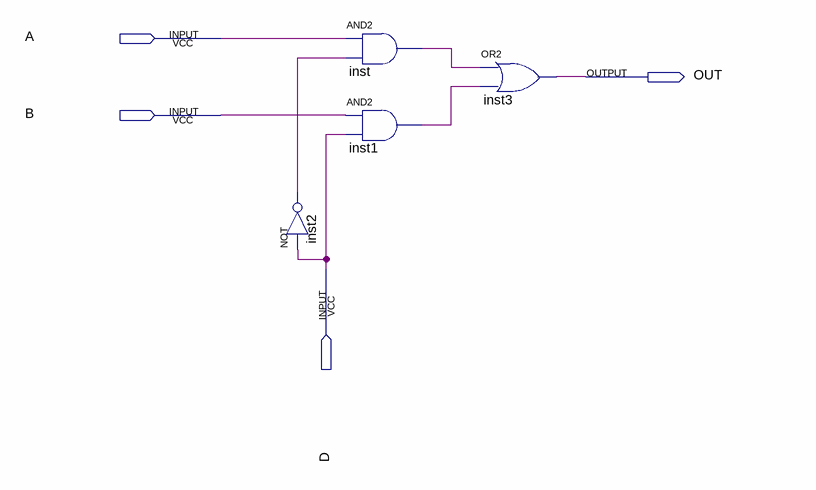
[diagram p0: schematic sheet]
// Quartus schematic multiplexer_2x1.bdf as structural Verilog: 4 symbols, 4 pins
module multiplexer_2x1 (
  input  A,
  input  B,
  input  D,
  output OUT
);

  wire inst1_out, inst2_out, inst_out;

  not inst2 (inst2_out, D);
  and inst (inst_out, A, inst2_out);
  and inst1 (inst1_out, B, D);
  or inst3 (OUT, inst_out, inst1_out);
endmodule
